# EAGLE schematic roboproj2q1 (EAGLE 9.6.2)
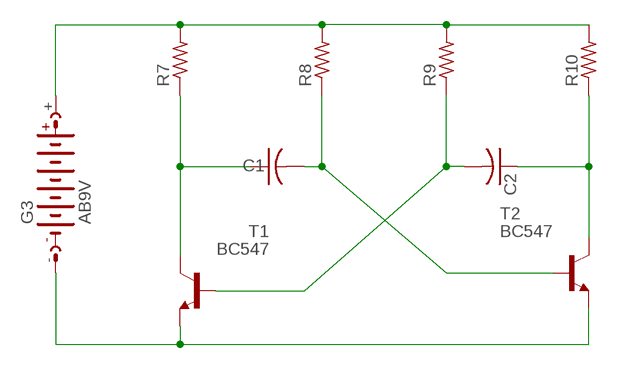
[diagram p0: schematic, sheet 1]

## Parts
C1  C-USC0805  [C0805]
C2  C-USC0805  [C0805]
G3  AB9V  [AB9V]
R7  R-US_R0805  [R0805]
R8  R-US_R0805  [R0805]
R9  R-US_R0805  [R0805]
R10  R-US_R0805  [R0805]
T1  BC547  [TO92]
T2  BC547  [TO92]

## Nets
N$7: C1.1 R7.1 T1.3(C)
N$8: G3.- T1.1(E) T2.1(E)
N$9: C2.1 R10.1 T2.3(C)
N$10: C2.2 R9.1 T1.2(B)
N$11: C1.2 R8.1 T2.2(B)
N$12: G3.+ R7.2 R8.2 R9.2 R10.2

## Library data of the parts
C1 C2 = rcl:C-US: CAPACITOR, American symbol; SPICEPREFIX: C
G3 = battery:AB9V: 9-V BATTERY CLIP
R7-R10 = rcl:R-US_: RESISTOR, American symbol; SPICEPREFIX: R
T1 T2 = transistor:BC547: NPN TRANSISTOR